# Altium schematic sheet Chip_select_mux.SchDoc: RP2040 CNC
size B; Author: AM; CompanyName: Expatria Technologies; DrawnBy: A.Marles; Engineer: AM; Organization: Expatria Technolgoies; Address1: 1136 Glade Court; Address3: Port Coquitlam, BC V3B 1R5; Address4: Canada; DocumentNumber: 12; SheetNumber: 12; SheetTotal: 30
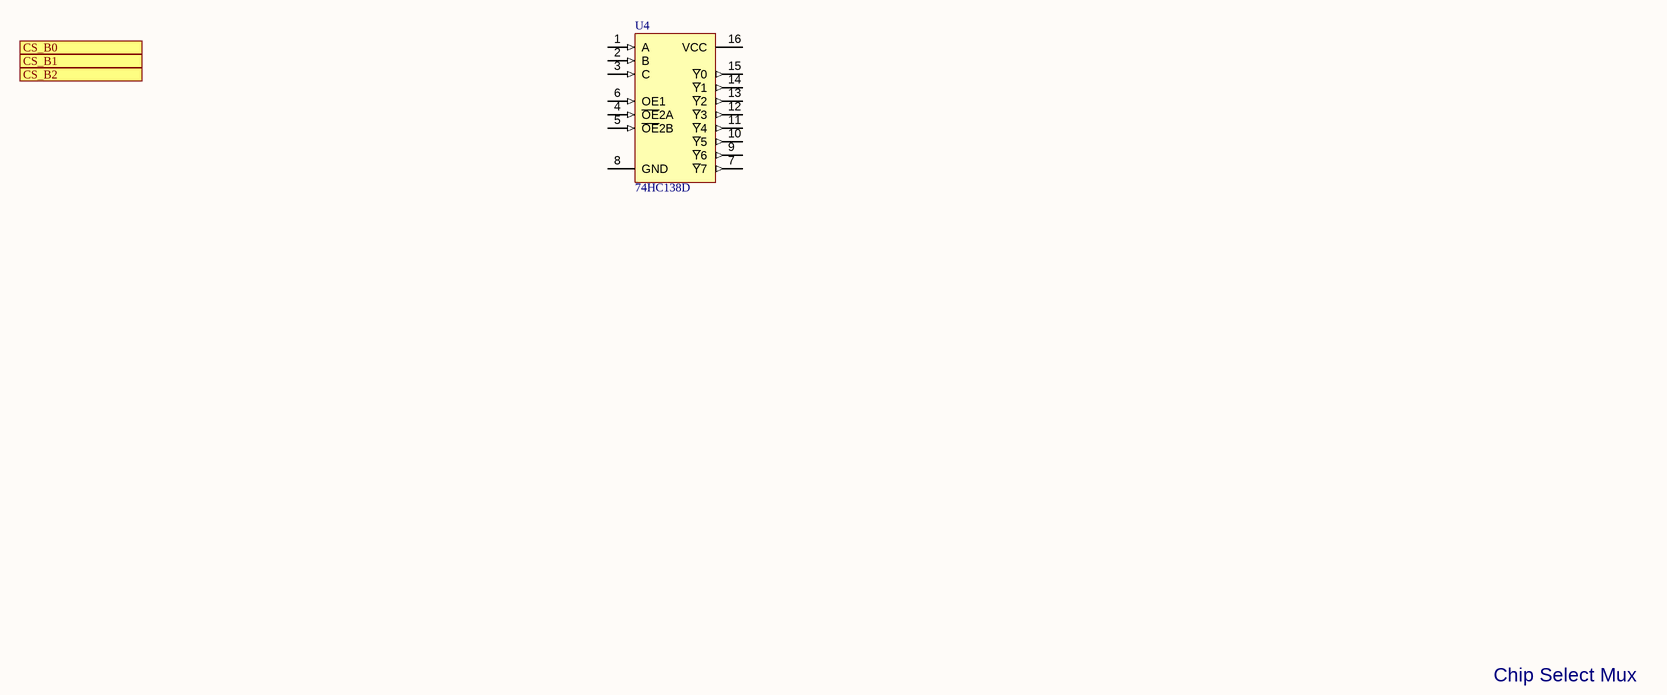
[diagram p0: Chip_select_mux.SchDoc]

## Parts
U4  74HC138D  [SOIC-16_150mil]

## Ports
CS_B0 (out), CS_B1 (out), CS_B2 (out)

## Nets

Not connected (* = marked no-connect by the designer): U4 1(A) 2(B) 3(C) 4(~{OE}2A) 5(~{OE}2B) 6(OE1) 7(~{Y}7) 8(GND) 9(~{Y}6) 10(~{Y}5) 11(~{Y}4) 12(~{Y}3) 13(~{Y}2) 14(~{Y}1) 15(~{Y}0) 16(VCC)

## Notes on the sheet
- Chip Select Mux
- SHEET
- Expatria Technologies
- 1136 Glade Court
- Port Coquitlam, BC V3B 1R5
- PHONE: (778) 238-9336
- PROJECT
- SIZE
- ENGR
- MODIFIED
- DOCUMENT
- REV
- Copyright Expatria Technologies 2022. This document describes Open Hardware and is licensed under the CERN-OHL-S v2. No warranty is implied or expressed.
- EMAIL: info@expatria.ca
- B
- /

## Library data of the parts
U4 = 74HC138D_[C5602]: 3 to 8 demux; ComponentLink1Description: 供应商链接; ComponentLink1URL: http://www.szlcsc.com/product/details_6053.html; Package: SOIC-16_150mil; Supplier: LC; SuppliersPartNumber: C5602